# EAGLE schematic MainBoard_V4 (EAGLE 6.1)
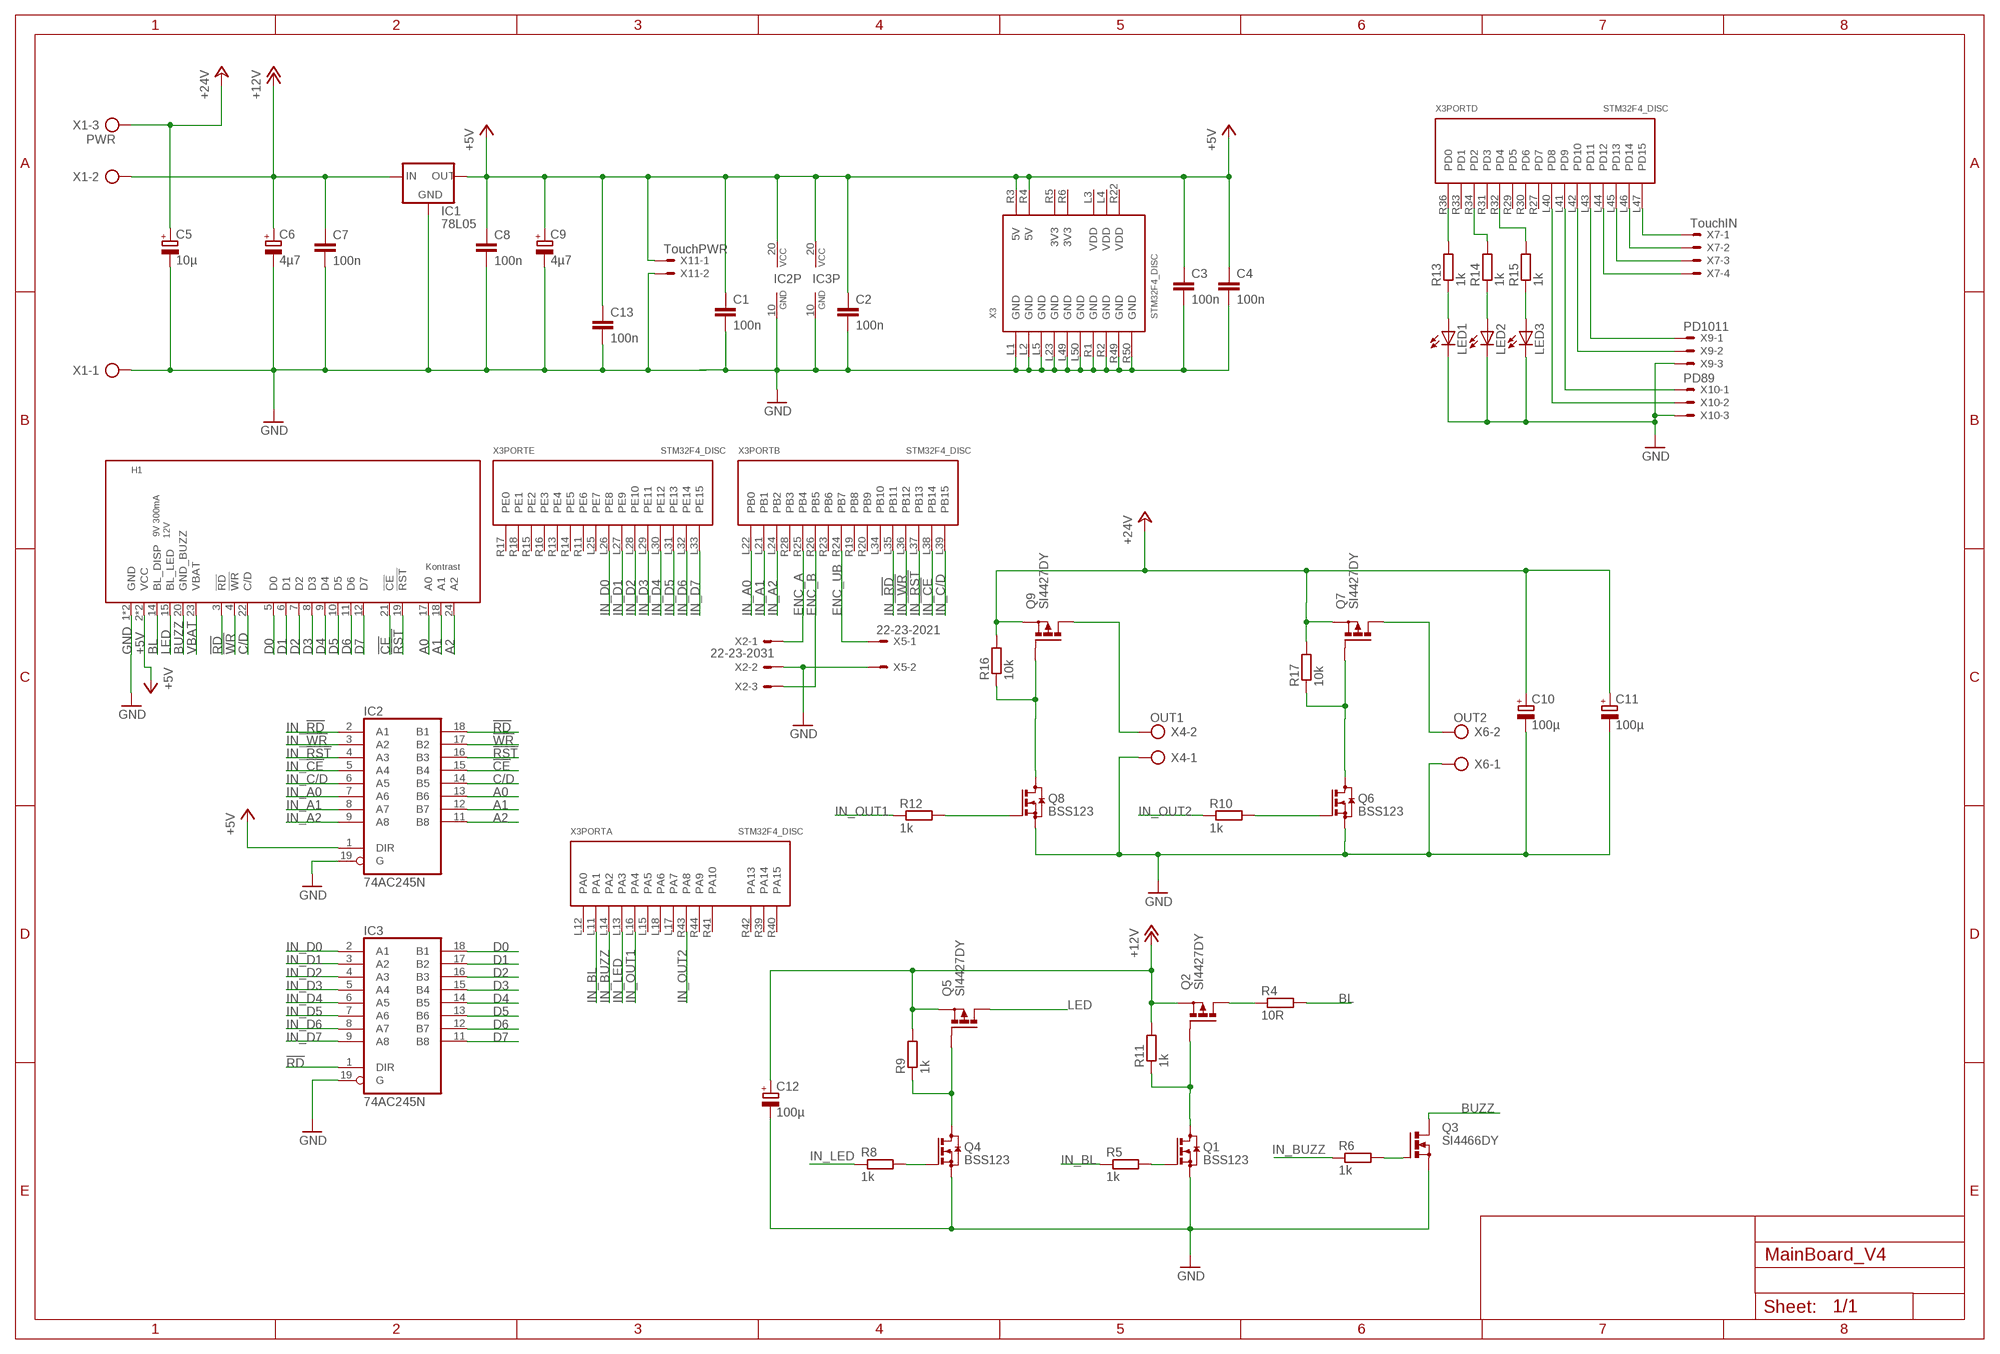
[diagram p0: schematic, sheet 1]

## Parts
C1  100n  C-EUC1206  [C1206]
C2  100n  C-EUC1206  [C1206]
C3  100n  C-EUC1206  [C1206]
C4  100n  C-EUC1206  [C1206]
C5  10µ  CPOL-EUE2-5  [E2-5]
C6  4µ7  CPOL-EUE2-5  [E2-5]
C7  100n  C-EUC1206  [C1206]
C8  100n  C-EUC1206  [C1206]
C9  4µ7  CPOL-EUE2-5  [E2-5]
C10  100µ  CPOL-EUE2-5  [E2-5]
C11  100µ  CPOL-EUE2-5  [E2-5]
C12  100µ  CPOL-EUE2-5  [E2-5]
C13  100n  C-EUC1206  [C1206]
H1  YL_24012-70-MICROMATCH  [YL24012-70-MICROMATCH]
IC1  78L05  78XXS  [78XXS]
IC2  74AC245N  [DIL20]
IC3  74AC245N  [DIL20]
LED1  LED3MM  [LED3MM]
LED2  LED3MM  [LED3MM]
LED3  LED3MM  [LED3MM]
Q1  BSS123  [SOT23]
Q2  SI4427DY  P-MOSFET-SO8  [SO-08]
Q3  SI4466DY  N-MOSFET-SO8S  [SO-08]
Q4  BSS123  [SOT23]
Q5  SI4427DY  P-MOSFET-SO8  [SO-08]
Q6  BSS123  [SOT23]
Q7  SI4427DY  P-MOSFET-SO8  [SO-08]
Q8  BSS123  [SOT23]
Q9  SI4427DY  P-MOSFET-SO8  [SO-08]
R4  10R  R-EU_0414/15  [0414/15]
R5  1k  R-EU_0207/7  [0207/7]
R6  1k  R-EU_0207/7  [0207/7]
R8  1k  R-EU_0207/12  [0207/12]
R9  1k  R-EU_R1206  [R1206]
R10  1k  R-EU_R1206  [R1206]
R11  1k  R-EU_R1206  [R1206]
R12  1k  R-EU_0207/7  [0207/7]
R13  1k  R-EU_0207/10  [0207/10]
R14  1k  R-EU_0207/10  [0207/10]
R15  1k  R-EU_0207/10  [0207/10]
R16  10k  R-EU_R1206  [R1206]
R17  10k  R-EU_R1206  [R1206]
X1  PWR  AK500/3  [AK500/3]
X2  22-23-2031  [22-23-2031]
X3  STM32F4_DISC  [STM32F4_DISC]
X4  OUT1  AK500/2  [AK500/2]
X5  22-23-2021  [22-23-2021]
X6  OUT2  AK500/2  [AK500/2]
X7  TouchIN  22-23-2041  [22-23-2041]
X9  PD1011  22-23-2031  [22-23-2031]
X10  PD89  22-23-2031  [22-23-2031]
X11  TouchPWR  22-23-2021  [22-23-2021]

## Nets
!CE: H1.21(!CE) IC2.15(B4)
!RD: H1.3(!RD) IC2.18(B1) IC3.1(DIR)
!RST: H1.19(!RST) IC2.16(B3)
!WR: H1.4(!WR) IC2.17(B2)
+5V: C1.1 C2.1 C3.1 C4.1 C8.1 C9.+ C13.1 H1.2(VCC) H1.16(VCC) IC1.OUT IC2.1(DIR) IC2.20(VCC) IC3.20(VCC) X3.R3(5V) X3.R4(5V) X11.1
+12V: C6.+ C7.1 C12.+ IC1.IN Q2.1(S) Q2.2(S) Q2.3(S) Q5.1(S) Q5.2(S) Q5.3(S) R9.2 R11.2 X1.2
+24V: C5.+ C10.+ C11.+ Q7.1(S) Q7.2(S) Q7.3(S) Q9.1(S) Q9.2(S) Q9.3(S) R16.2 R17.2 X1.3
A0: H1.17(A0) IC2.13(B6)
A1: H1.18(A1) IC2.12(B7)
A2: H1.24(A2) IC2.11(B8)
BL: H1.14(BL_DISP) R4.2
BUZZ: H1.20(GND_BUZZ) Q3.5(D) Q3.6(D) Q3.7(D) Q3.8(D)
C/D: H1.22(C/D) IC2.14(B5)
D0: H1.5(D0) IC3.18(B1)
D1: H1.6(D1) IC3.17(B2)
D2: H1.7(D2) IC3.16(B3)
D3: H1.8(D3) IC3.15(B4)
D4: H1.9(D4) IC3.14(B5)
D5: H1.10(D5) IC3.13(B6)
D6: H1.11(D6) IC3.12(B7)
D7: H1.12(D7) IC3.11(B8)
ENC_A: X2.1 X3.R25(PB4)
ENC_B: X2.3 X3.R26(PB5)
ENC_UB: X3.R24(PB7) X5.1
GND: C1.2 C2.2 C3.2 C4.2 C5.- C6.- C7.2 C8.2 C9.- C10.- C11.- C12.- C13.2 H1.1(GND) H1.13(GND) IC1.GND IC2.10(GND) IC2.19(G) IC3.10(GND) IC3.19(G) LED1.K(C) LED2.K(C) LED3.K(C) Q1.2(S) Q3.1(S) Q3.2(S) Q3.3(S) Q4.2(S) Q6.2(S) Q8.2(S) X1.1 X2.2 X3.L1(GND) X3.L2(GND) X3.L5(GND) X3.L23(GND) X3.L49(GND) X3.L50(GND) X3.R1(GND) X3.R2(GND) X3.R49(GND) X3.R50(GND) X4.1 X5.2 X6.1 X9.3 X10.3 X11.2
IN_!CE: IC2.5(A4) X3.L38(PB14)
IN_!RD: IC2.2(A1) X3.L35(PB11)
IN_!RST: IC2.4(A3) X3.L37(PB13)
IN_!WR: IC2.3(A2) X3.L36(PB12)
IN_A0: IC2.7(A6) X3.L22(PB0)
IN_A1: IC2.8(A7) X3.L21(PB1)
IN_A2: IC2.9(A8) X3.L24(PB2)
IN_BL: R5.1 X3.L11(PA1)
IN_BUZZ: R6.1 X3.L14(PA2)
IN_C/D: IC2.6(A5) X3.L39(PB15)
IN_D0: IC3.2(A1) X3.L26(PE8)
IN_D1: IC3.3(A2) X3.L27(PE9)
IN_D2: IC3.4(A3) X3.L28(PE10)
IN_D3: IC3.5(A4) X3.L29(PE11)
IN_D4: IC3.6(A5) X3.L30(PE12)
IN_D5: IC3.7(A6) X3.L31(PE13)
IN_D6: IC3.8(A7) X3.L32(PE14)
IN_D7: IC3.9(A8) X3.L33(PE15)
IN_LED: R8.1 X3.L13(PA3)
IN_OUT1: R12.1 X3.L16(PA4)
IN_OUT2: R10.1 X3.R43(PA8)
LED: H1.15(BL_LED) Q5.5(D) Q5.6(D) Q5.7(D) Q5.8(D)
LED1: Q7.5(D) Q7.6(D) Q7.7(D) Q7.8(D) X6.2
LED2: Q9.5(D) Q9.6(D) Q9.7(D) Q9.8(D) X4.2
N$1: R15.2 X3.R32(PD4)
N$2: R14.2 X3.R34(PD2)
N$4: Q1.3(D) Q2.4(G) R11.1
N$5: Q2.5(D) Q2.6(D) Q2.7(D) Q2.8(D) R4.1
N$6: Q1.1(G) R5.2
N$7: Q4.3(D) Q5.4(G) R9.1
N$8: Q3.4(G) R6.2
N$11: Q4.1(G) R8.2
N$12: Q6.3(D) Q7.4(G) R17.1
N$13: Q6.1(G) R10.2
N$15: Q8.3(D) Q9.4(G) R16.1
N$16: Q8.1(G) R12.2
N$17: LED1.A R13.1
N$18: LED2.A R14.1
N$19: LED3.A R15.1
N$20: X3.L40(PD8) X10.2
N$21: X3.L41(PD9) X10.1
N$22: X3.L42(PD10) X9.2
N$23: X3.L43(PD11) X9.1
N$24: X3.L44(PD12) X7.4
N$25: X3.L45(PD13) X7.3
N$26: X3.L46(PD14) X7.2
N$27: X3.L47(PD15) X7.1
N$28: R13.2 X3.R36(PD0)
VBAT: H1.23(VBAT)
Unconnected: X3.L6(!RST) X3.L7(PC1) X3.L8(PC0) X3.L9(PC3) X3.L10(PC2) X3.L12(PA0) X3.L15(PA5) X3.L17(PA7) X3.L18(PA6) X3.L19(PC4) X3.L20(PC5) X3.L25(PE7) X3.L34(PB10) X3.L48(NC) X3.R7(PH0) X3.R8(PH1) X3.R9(PC14) X3.R10(PC15) X3.R11(PE6) X3.R12(PC13) X3.R13(PE4) X3.R14(PE5) X3.R15(PE2) X3.R16(PE3) X3.R17(PE0) X3.R18(PE1) X3.R19(PB8) X3.R20(PB9) X3.R21(BOOT0) X3.R23(PB6) X3.R27(PD7) X3.R28(PB3) X3.R29(PD5) X3.R30(PD6) X3.R31(PD3) X3.R33(PD1) X3.R35(PC12) X3.R37(PC10) X3.R38(PC11) X3.R39(PA14) X3.R40(PA15) X3.R41(PA10) X3.R42(PA13) X3.R44(PA9) X3.R45(PC8) X3.R46(PC9) X3.R47(PC6) X3.R48(PC7) X3.T1(JP2A) X3.T2(JP2B) X3.T3(JP3A) X3.T4(JP3B)

## Power pins joined to a net without a drawn wire
3V3: X3.R5(3V3) X3.R6(3V3)
VDD: X3.L3(VDD) X3.L4(VDD) X3.R22(VDD)

## Library data of the parts
C1-C4 C7 C8 C13 = rcl:C-EU: CAPACITOR, European symbol
C5 C6 C9-C12 = rcl:CPOL-EU: POLARIZED CAPACITOR, European symbol
H1 = GLCD-YL240:YL_24012-70-MICROMATCH
IC1 = v-reg:78XXS: VOLTAGE REGULATOR
IC2 IC3 = 74xx-eu:74*245: Octal BUS TRANSCEIVER, 3-state
LED1-LED3 = led:LED: LED OSRAM: - CHIPLED LG R971, LG N971, LY N971, LG Q971, LY Q971, LO R971, LY R971 LH N974, LH R974 LS Q976, LO Q976, LY Q976 LO Q996 - Hyper CHIPLED LW Q18S LB Q993, LB Q99A, LB R99A - SideLED LS A670, LO A670, LY A670, LG A670, LP A670 LB A673, LV A673, LT A673, LW A673 LH A674 LY A675 LS A676, LA A676, LO A676, LY A676, LW A676 LS A679, LY A679, LG A679 - Hyper Micro SIDELED® LS Y876, LA Y876, LO Y876, LY Y876 LT Y87S - SmartLED LW L88C, LW L88S LB L89C, LB L89S, LG L890 LS L89K, LO L89K, LY L89K LS L896, LA L896, LO L896, LY L896 - TOPLED LS T670, LO T670, LY T670, LG T670, LP T670 LSG T670, LSP T670, LSY T670, LOP T670, LYG T670 LG T671, LOG T671, LSG T671 LB T673, LV T673, LT T673, LW T673 LH T674 LS T676, LA T676, LO T676, LY T676, LB T676, LH T676, LSB T676, LW T676 LB T67C, LV T67C, LT T67C, LS T67K, LO T67K, LY T67K, LW E67C LS E67B, LA E67B, LO E67B, LY E67B, LB E67C, LV E67C, LT E67C LW T67C LS T679, LY T679, LG T679 LS T770, LO T770, LY T770, LG T770, LP T770 LB T773, LV T773, LT T773, LW T773 LH T774 LS E675, LA E675, LY E675, LS T675 LS T776, LA T776, LO T776, LY T776, LB T776 LHGB T686 LT T68C, LB T68C - Hyper Mini TOPLED® LB M676 - Mini TOPLED Santana® LG M470 LS M47K, LO M47K, LY M47K Source: http://www.osram.convergy.de LUXEON: - LUMILED® LXK2-PW12-R00, LXK2-PW12-S00, LXK2-PW14-U00, LXK2-PW14-V00 LXK2-PM12-R00, LXK2-PM12-S00, LXK2-PM14-U00 LXK2-PE12-Q00, LXK2-PE12-R00, LXK2-PE12-S00, LXK2-PE14-T00, LXK2-PE14-U00 LXK2-PB12-K00, LXK2-PB12-L00, LXK2-PB12-M00, LXK2-PB14-N00, LXK2-PB14-P00, LXK2-PB14-Q00 LXK2-PR12-L00, LXK2-PR12-M00, LXK2-PR14-Q00, LXK2-PR14-R00 LXK2-PD12-Q00, LXK2-PD12-R00, LXK2-PD12-S00 LXK2-PH12-R00, LXK2-PH12-S00 LXK2-PL12-P00, LXK2-PL12-Q00, LXK2-PL12-R00 Source: www.luxeon.com KINGBRIGHT: KA-3528ASYC Source: www.kingbright.com
Q1 Q4 Q6 Q8 = transistor-small-signal:BSS123: N-CHANNEL MOS FET
Q2 Q5 Q7 Q9 = transistor-power:P-MOSFET-SO8: P-Channel MOSFET Example: FDS4435A; P-Channel Logic Level PowerTrench® MOSFET FDS4465; P-Channel 1.8V Specified PowerTrench® MOSFET Source: www.fairchildsemi.com
Q3 = transistor-power:N-MOSFET-SO8: N-Channel MOSFET Example: FDS7760A; N-Channel Logic Level PowerTrench® MOSFET FDS2572; N-Channel UltraFET® Trench MOSFET Source: www.fairchildsemi.com
R4-R6 R8-R17 = rcl:R-EU_: RESISTOR, European symbol
X1 = con-ptr500:AK500/3: CONNECTOR; OC_FARNELL: unknown; OC_NEWARK: unknown
X2 X9 X10 = con-molex:22-23-2031: .100" (2.54mm) Center Header - 3 Pin; MF: MOLEX; MPN: 22-23-2031; OC_FARNELL: 1462950; OC_NEWARK: 30C0862
X3 = stm32f4_disc:STM32F4_DISC: STM32F4 Discovery Board
X4 X6 = con-ptr500:AK500/2: CONNECTOR; OC_FARNELL: unknown; OC_NEWARK: unknown
X5 X11 = con-molex:22-23-2021: .100" (2.54mm) Center Header - 2 Pin; MF: MOLEX; MPN: 22-23-2021; OC_FARNELL: 1462926; OC_NEWARK: 25C3832
X7 = con-molex:22-23-2041: .100" (2.54mm) Center Header - 4 Pin; MF: MOLEX; MPN: 22-23-2041; OC_FARNELL: 1462920; OC_NEWARK: 38C0355